# Altium schematic sheet 32P MCU.SchDoc
size A; SheetNumber: 7; SheetTotal: 7
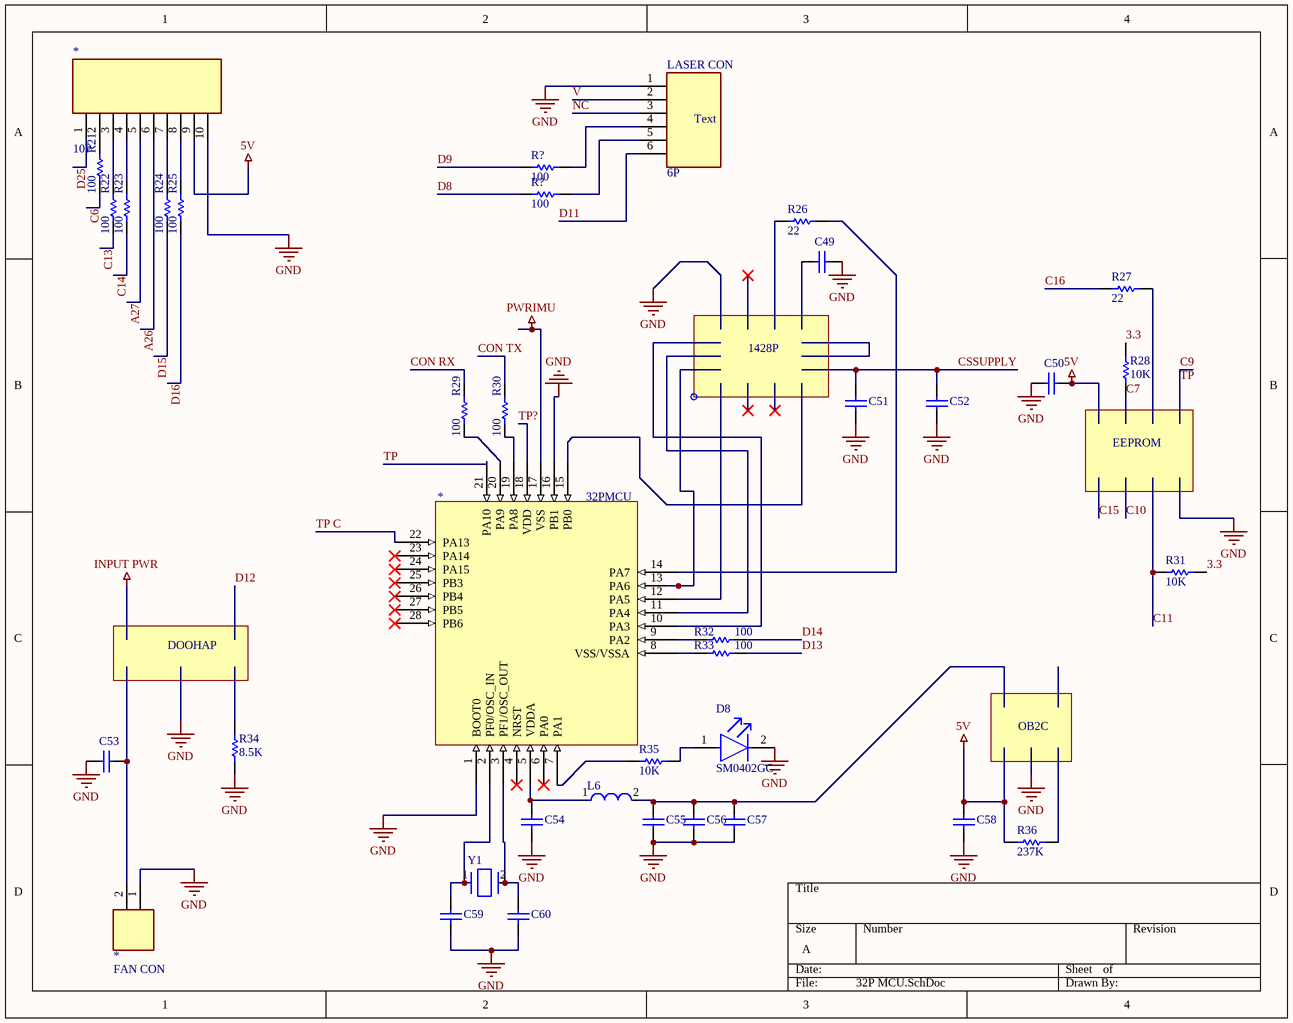
[diagram p0: 32P MCU.SchDoc]

## Parts
(Parts that share a designator on the sheet are numbered #1, #2 ... from top to bottom, then left to right.)
*#1  10P
*#2  32PMCU
*#3  FAN CON
C49  (no value)  [CAPC1005X56X25LL10T15]
C50  (no value)  [CAPC1005X56X25LL10T15]
C51  (no value)  [CAPC1005X56X25LL10T15]
C52  (no value)  [CAPC1005X56X25LL10T15]
C53  (no value)  [CAPC1005X56X25LL10T15]
C54  (no value)  [CAPC1005X56X25LL10T15]
C55  (no value)  [CAPC1005X56X25LL10T15]
C56  (no value)  [CAPC1005X56X25LL10T15]
C57  (no value)  [CAPC1005X56X25LL10T15]
C58  (no value)  [CAPC1005X56X25LL10T15]
C59  (no value)  [CAPC1005X56X25LL10T15]
C60  (no value)  [CAPC1005X56X25LL10T15]
D8  SM0402GC  [FP-SM0402GC-MFG]
L6  (no value)  [FP-LQH31CN_03-MFG]
LASER_CON  6P
R21  100  [RESC1005X40X25LL05T10]
R22  100  [RESC1005X40X25LL05T10]
R23  100  [RESC1005X40X25LL05T10]
R24  100  [RESC1005X40X25LL05T10]
R25  100  [RESC1005X40X25LL05T10]
R26  22  [RESC1005X40X25LL05T10]
R27  22  [RESC1005X40X25LL05T10]
R28  10K  [RESC1005X40X25LL05T10]
R29  100  [RESC1005X40X25LL05T10]
R30  100  [RESC1005X40X25LL05T10]
R31  10K  [RESC1005X40X25LL05T10]
R32  100  [RESC1005X40X25LL05T10]
R33  100  [RESC1005X40X25LL05T10]
R34  8.5K  [RESC1005X40X25LL05T10]
R35  10K  [RESC1005X40X25LL05T10]
R36  237K  [RESC1005X40X25LL05T10]
R?#1  100  [RESC1005X40X25LL05T10]
R?#2  100  [RESC1005X40X25LL05T10]
Y1  (no value)  [FP-TFE20-MFG]

## Nets
5V: *#1.9 C50.1 C58.2 R36.2
GND: *#1.10 *#2.1(BOOT0) *#2.16(PB1) *#3.1 C49.2 C50.2 C51.2 C52.2 C53.1 C54.1 C55.1 C56.1 C57.1 C58.1 C59.1 C60.1 D8.2(C) LASER_CON.1 R34.1
PWRIMU: *#2.17(VSS)
3.3: R28.1 R31.1
A26: *#1.6
A27: *#1.5
C6: R21.1
C7: R28.2
C9: *#2.21(PA10)  [also labelled TP]
C11: R31.2
C13: R22.1
C14: R23.1
C16: R27.1
CON RX: R29.2
CON TX: R30.2
CSSUPPLY: C51.1 C52.1
D8: R?#2.1
D9: R?#1.1
D11: LASER_CON.6
D13: R33.2
D14: R32.2
D15: R24.1
D16: R25.1
D25: *#1.1
NC: LASER_CON.3
TP C: *#2.22(PA13)
TP?: *#2.18(VDD)
V: LASER_CON.2
Net*#1_2: *#1.2 R21.2
Net*#1_3: *#1.3 R22.2
Net*#1_4: *#1.4 R23.2
Net*#1_7: *#1.7 R24.2
Net*#1_8: *#1.8 R25.2
Net*#2_2: *#2.2(PF0/OSC_IN) C59.2 Y1.1
Net*#2_3: *#2.3(PF1/OSC_OUT) C60.2 Y1.2
Net*#2_5: *#2.5(VDDA) C54.2 L6.1
Net*#2_7: *#2.7(PA1) R35.2
Net*#2_8: *#2.8(VSS/VSSA) R33.1
Net*#2_9: *#2.9(PA2) R32.1
Net*#2_14: *#2.14(PA7) R26.1
Net*#2_19: *#2.19(PA8) R30.1
Net*#2_20: *#2.20(PA9) R29.1
Net*#3_2: *#3.2 C53.2
NetC55_2: C55.2 C56.2 C57.2 L6.2
NetD8_1: D8.1(A) R35.1
NetLASER_CON_4: LASER_CON.4 R?#1.2
NetLASER_CON_5: LASER_CON.5 R?#2.2

Not connected (* = marked no-connect by the designer): *#2 4(NRST)* 6(PA0)* 10(PA3) 11(PA4) 12(PA5) 13(PA6) 15(PB0) 23(PA14)* 24(PA15)* 25(PB3)* 26(PB4)* 27(PB5)* 28(PB6)*; C49 1; R26 2; R27 2; R34 2; R36 1

## Notes on the sheet
- (near LASER_CON) Text
- 1428P
- EEPROM
- DOOHAP
- OB2C

## Library data of the parts
*#3 = 2P
C49-C60 = CMP-2008-02962-1
D8 = CMP-35283-000001-2: LED GREEN CLEAR 0402 SMD; Lens Size: 1mm; Luminous Intensity: 28.5mcd; Viewing Angle: 130°; Forward Voltage: 1.9V; Test Current: 20mA; Lens Color: Colorless; Lens Style: Flat; Dominant Wavelength: 572nm; Case Code (Metric): 1005; Mount: Surface Mount; Case Code (Imperial): 0402; Length: 1mm; Width: 0.5mm; Case/Package: 0402; Lens Transparency: Clear; Height: 0.71mm; Packaging: Tape and Reel; Color: Green
L6 = CMP-06042-002477-1
R21-R36 R?#1 R?#2 = CMP-2002-07161-1
  R21-R25 R29 R30 R32 R33 R?#1 R?#2: VALUE: 100
  R26 R27: VALUE: 22
  R28 R31 R35: VALUE: 10K
  R34: VALUE: 8.5K
  R36: VALUE: 237K
Y1 = CMP-06858-000002-1